# EAGLE design Beta22_SMD (EAGLE 9.4.2)
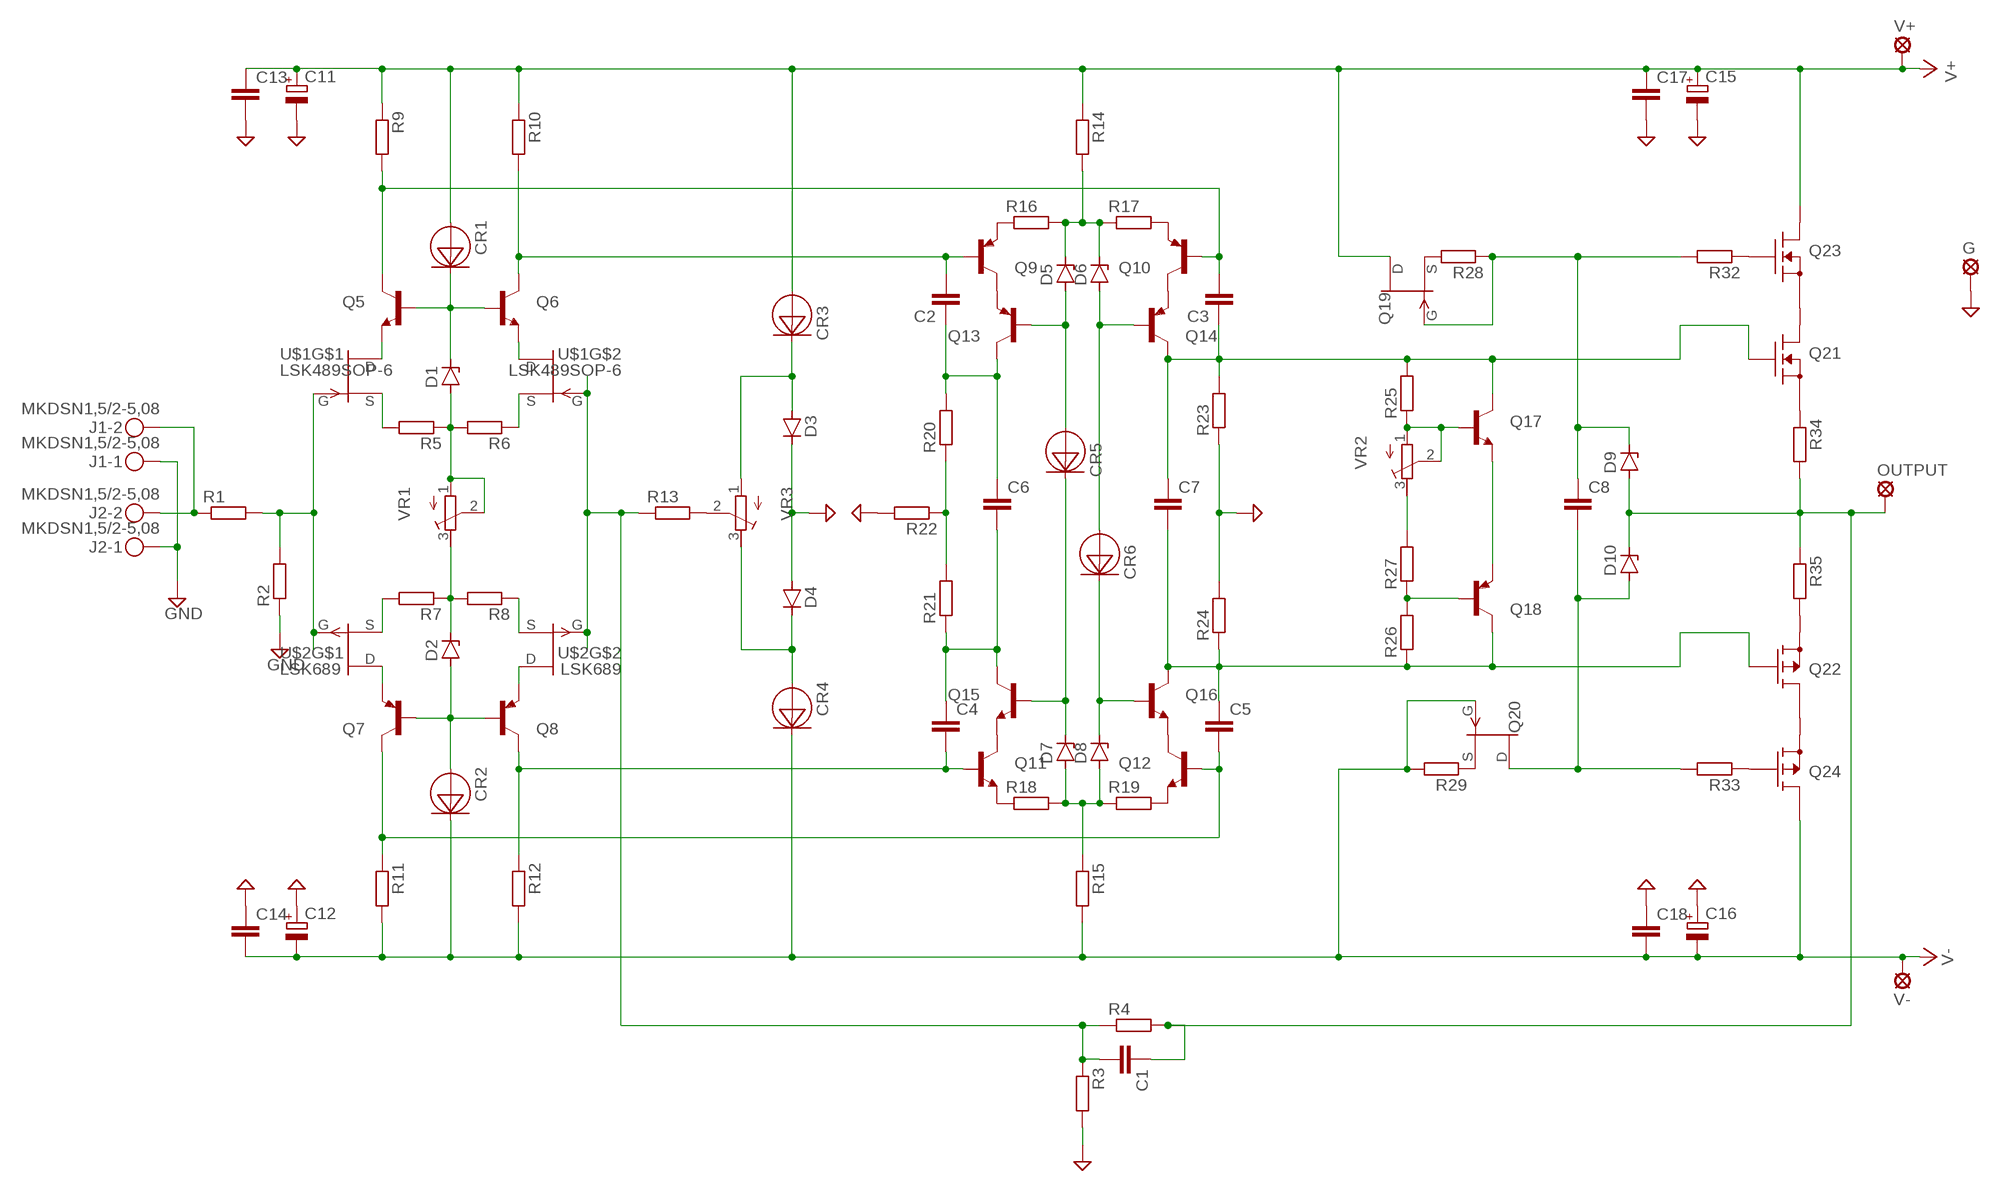
[diagram p0: schematic, sheet 1]

## Parts
C1  C-EUC0805  [C0805]
C2  C-EUC0805  [C0805]
C3  C-EUC0805  [C0805]
C4  C-EUC0805  [C0805]
C5  C-EUC0805  [C0805]
C6  C-EUC0805  [C0805]
C7  C-EUC0805  [C0805]
C8  C-EUC0805  [C0805]
C11  CPOL-EUE5-13  [E5-13]
C12  CPOL-EUE5-13  [E5-13]
C13  C-EU050-055X075  [C050-055X075]
C14  C-EU050-055X075  [C050-055X075]
C15  CPOL-EUE7.5-18  [E7,5-18]
C16  CPOL-EUE7.5-18  [E7,5-18]
C17  C-EU050-055X075  [C050-055X075]
C18  C-EU050-055X075  [C050-055X075]
CR1  1N5283  [SMD]
CR2  1N5283  [SMD]
CR3  1N5283  [SMD]
CR4  1N5283  [SMD]
CR5  1N5283  [SMD]
CR6  1N5283  [SMD]
D1  ZENER-DIODESOD80C  [SOD80C]
D2  ZENER-DIODESOD80C  [SOD80C]
D3  DIODE-SOD80C  [SOD80C]
D4  DIODE-SOD80C  [SOD80C]
D5  ZENER-DIODESOD80C  [SOD80C]
D6  ZENER-DIODESOD80C  [SOD80C]
D7  ZENER-DIODESOD80C  [SOD80C]
D8  ZENER-DIODESOD80C  [SOD80C]
D9  ZENER-DIODESOD80C  [SOD80C]
D10  ZENER-DIODESOD80C  [SOD80C]
G  SE14  [SE14]
J1  MKDSN1,5/2-5,08  [MKDSN1,5/2-5,08]
J2  MKDSN1,5/2-5,08  [MKDSN1,5/2-5,08]
OUTPUT  SE14  [SE14]
Q5  BC550C  [TO92-EBC]
Q6  BC550C  [TO92-EBC]
Q7  BC560  [TO92_1]
Q8  BC560  [TO92_1]
Q9  BC560  [TO92_1]
Q10  BC560  [TO92_1]
Q11  BC550C  [TO92-EBC]
Q12  BC550C  [TO92-EBC]
Q13  BC560  [TO92_1]
Q14  BC560  [TO92_1]
Q15  BC550C  [TO92-EBC]
Q16  BC550C  [TO92-EBC]
Q17  BC550C  [TO92-EBC]
Q18  BC560  [TO92_1]
Q19  SST5486  [SOT23]
Q20  SST5486  [SOT23]
Q21  IRFZ24N  [TO220V]
Q22  IRFZ34N  [TO220V]
Q23  IRFZ24N  [TO220V]
Q24  IRFZ34N  [TO220V]
R1  R-EU_MELF0204W  [MINI_MELF-0204W]
R2  R-EU_MELF0204W  [MINI_MELF-0204W]
R3  R-EU_MELF0204W  [MINI_MELF-0204W]
R4  R-EU_MELF0204W  [MINI_MELF-0204W]
R5  R-EU_MELF0204W  [MINI_MELF-0204W]
R6  R-EU_MELF0204W  [MINI_MELF-0204W]
R7  R-EU_MELF0204W  [MINI_MELF-0204W]
R8  R-EU_MELF0204W  [MINI_MELF-0204W]
R9  R-EU_MELF0204W  [MINI_MELF-0204W]
R10  R-EU_MELF0204W  [MINI_MELF-0204W]
R11  R-EU_MELF0204W  [MINI_MELF-0204W]
R12  R-EU_MELF0204W  [MINI_MELF-0204W]
R13  R-EU_MELF0204W  [MINI_MELF-0204W]
R14  R-EU_MELF0204W  [MINI_MELF-0204W]
R15  R-EU_MELF0204W  [MINI_MELF-0204W]
R16  R-EU_MELF0204W  [MINI_MELF-0204W]
R17  R-EU_MELF0204W  [MINI_MELF-0204W]
R18  R-EU_MELF0204W  [MINI_MELF-0204W]
R19  R-EU_MELF0204W  [MINI_MELF-0204W]
R20  R-EU_MELF0204W  [MINI_MELF-0204W]
R21  R-EU_MELF0204W  [MINI_MELF-0204W]
R22  R-EU_MELF0204W  [MINI_MELF-0204W]
R23  R-EU_MELF0204W  [MINI_MELF-0204W]
R24  R-EU_MELF0204W  [MINI_MELF-0204W]
R25  R-EU_MELF0204W  [MINI_MELF-0204W]
R26  R-EU_MELF0204W  [MINI_MELF-0204W]
R27  R-EU_MELF0204W  [MINI_MELF-0204W]
R28  R-EU_MELF0204W  [MINI_MELF-0204W]
R29  R-EU_MELF0204W  [MINI_MELF-0204W]
R32  R-EU_MELF0204W  [MINI_MELF-0204W]
R33  R-EU_MELF0204W  [MINI_MELF-0204W]
R34  R-EU_0617/17  [0617/17]
R35  R-EU_0617/17  [0617/17]
U$1  LSK489SOP-6  [SOT-23-6]
U$2  LSK689  [SOT-23-6]
V+  SE14  [SE14]
V-  SE14  [SE14]
VR1  R-TRIMM3296W  [RTRIM3296W]
VR2  R-TRIMM3296W  [RTRIM3296W]
VR3  R-TRIMM3296W  [RTRIM3296W]

## Nets
GND: C11.- C12.+ C13.2 C14.1 C15.- C16.+ C17.2 C18.1 D3.C D4.A G.MP J1.1 J2.1 R2.1 R3.2 R22.2 R23.1 R24.2
N$1: R1.2 R2.2 U$1.1(G) U$2.1(G)
N$2: Q6.E U$1.5(D)
N$3: R5.2 U$1.3(S)
N$4: R7.2 U$2.3(S)
N$5: Q5.E U$1.2(D)
N$6: Q7.3(E) U$2.2(D)
N$7: R6.1 U$1.6(S)
N$8: D2.C R7.1 R8.2 VR1.3(E)
N$9: R8.1 U$2.6(S)
N$10: Q8.3(E) U$2.5(D)
N$11: D1.A R5.1 R6.2 VR1.1(A) VR1.2(S)
N$12: CR2.ANODE D2.A Q7.2(B) Q8.2(B)
N$13: C3.2 Q5.C Q10.2(B) R9.2
N$14: C2.2 Q6.C Q9.2(B) R10.2
N$15: CR4.ANODE D4.C VR3.3(E)
N$16: CR1.CATHODE D1.C Q5.B Q6.B
N$18: C5.2 Q7.1(C) Q12.B R11.1
N$19: J1.2 J2.2 R1.1
N$20: C8.2 D10.A Q20.1(D) R33.2
N$21: C1.2 R3.1 R4.1 R13.1 U$1.4(G) U$2.4(G)
N$22: R13.2 VR3.2(S)
N$23: Q9.1(C) Q13.3(E)
N$24: CR3.CATHODE D3.A VR3.1(A)
N$25: Q10.1(C) Q14.3(E)
N$26: C1.1 D9.A D10.C OUTPUT.MP R4.2 R34.2 R35.1
N$27: Q9.3(E) R16.1
N$28: Q10.3(E) R17.2
N$29: D5.C D6.C R14.2 R16.2 R17.1
N$30: Q11.E R18.1
N$31: Q12.E R19.2
N$32: D7.A D8.A R15.1 R18.2 R19.1
N$33: C4.2 Q8.1(C) Q11.B R12.1
N$34: R20.1 R21.2 R22.1
N$35: C2.1 C6.1 Q13.1(C) R20.2
N$36: C4.1 C6.2 Q15.C R21.1
N$37: Q11.C Q15.E
N$38: Q12.C Q16.E
N$39: Q17.B R25.1 VR2.1(A) VR2.2(S)
N$40: Q19.2(S) R28.2
N$41: Q20.2(S) R29.1
N$42: C3.1 C7.1 Q14.1(C) Q17.C Q21.1(G) R23.2 R25.2
N$43: CR5.ANODE D5.A Q13.2(B)
N$44: CR6.ANODE D6.A Q14.2(B)
N$45: CR5.CATHODE D7.C Q15.B
N$46: CR6.CATHODE D8.C Q16.B
N$47: Q18.2(B) R26.2 R27.1
N$48: R27.2 VR2.3(E)
N$49: Q17.E Q18.3(E)
N$50: C5.1 C7.2 Q16.C Q18.1(C) Q22.1(G) R24.1 R26.1
N$54: C8.1 D9.C Q19.3(G) R28.1 R32.2
N$57: Q21.2(D) Q23.3(S)
N$58: Q22.2(D) Q24.3(S)
N$59: Q23.1(G) R32.1
N$60: Q24.1(G) R33.1
N$62: Q21.3(S) R34.1
N$63: Q22.3(S) R35.2
V+: C11.+ C13.1 C15.+ C17.1 CR1.ANODE CR3.ANODE Q19.1(D) Q23.2(D) R9.1 R10.1 R14.1 V+.MP
V-: C12.- C14.2 C16.- C18.2 CR2.CATHODE CR4.CATHODE Q20.3(G) Q24.2(D) R11.2 R12.2 R15.2 R29.2 V-.MP

## Library data of the parts
C1-C8 C13 C14 C17 C18 = Vwvwbg:C-EU: CAPACITOR, European symbol
C11 C12 C15 C16 = Vwvwbg:CPOL-EU: POLARIZED CAPACITOR, European symbol
CR1-CR6 = crd:1N5283: 0.22 mA through 4.23 mA current regulating diode series
D1 D2 D5-D10 = diode:ZENER-DIODE: Z-Diode
D3 D4 = diode:DIODE-: DIODE
G OUTPUT V+ V- = solpad:SE14: SOLDER PAD E1553, drill 1,4mm, distributor Buerklin, 07F820
J1 J2 = con-phoenix-508:MKDSN1,5/2-5,08: MKDSN 1,5/ 2-5,08 Printklemme Nennstrom: 13,5 A Nennspannung: 250 V Rastermaß: 5,08 mm Polzahl: 2 Anschlussart: Schraubanschluss Montage: Löten Anschlussrichtung Leiter/Platine: 0 ° Artikelnummer: 1729128 Source: http://eshop.phoenixcontact.com .. 1729128.pdf
Q5 Q6 Q11 Q12 Q15-Q17 = transistor-npn:BC550*: NPN Transistor
Q7-Q10 Q13 Q14 Q18 = tranzistory PNP:BC560*: PNP Transistror
Q19 Q20 = transistor-fet:?548*: N-Channel JFETs Source: VISHAY 2N5484.pdf Compatible: TO92 2N5245 J304 J305 U310 J308 J309 J310 TO72 2N4416 2N4416A 2N3823 2N4351 3N169 3N170 3N171 MFE3002 TO18 2N3796 2N3797 MFE825 Source: Motorola European Master Guide Pacge 3-59
Q21 Q23 = transistor-fet:IRFZ24N
Q22 Q24 = transistor-fet:IRFZ34N
R1-R29 R32-R35 = Vwvwbg:R-EU_: RESISTOR, European symbol
U$1 = Vwvwbg:LSK489
U$2 = Vwvwbg:LSK689
VR1-VR3 = resistor:R-TRIMM: Trimm resistor

## Board
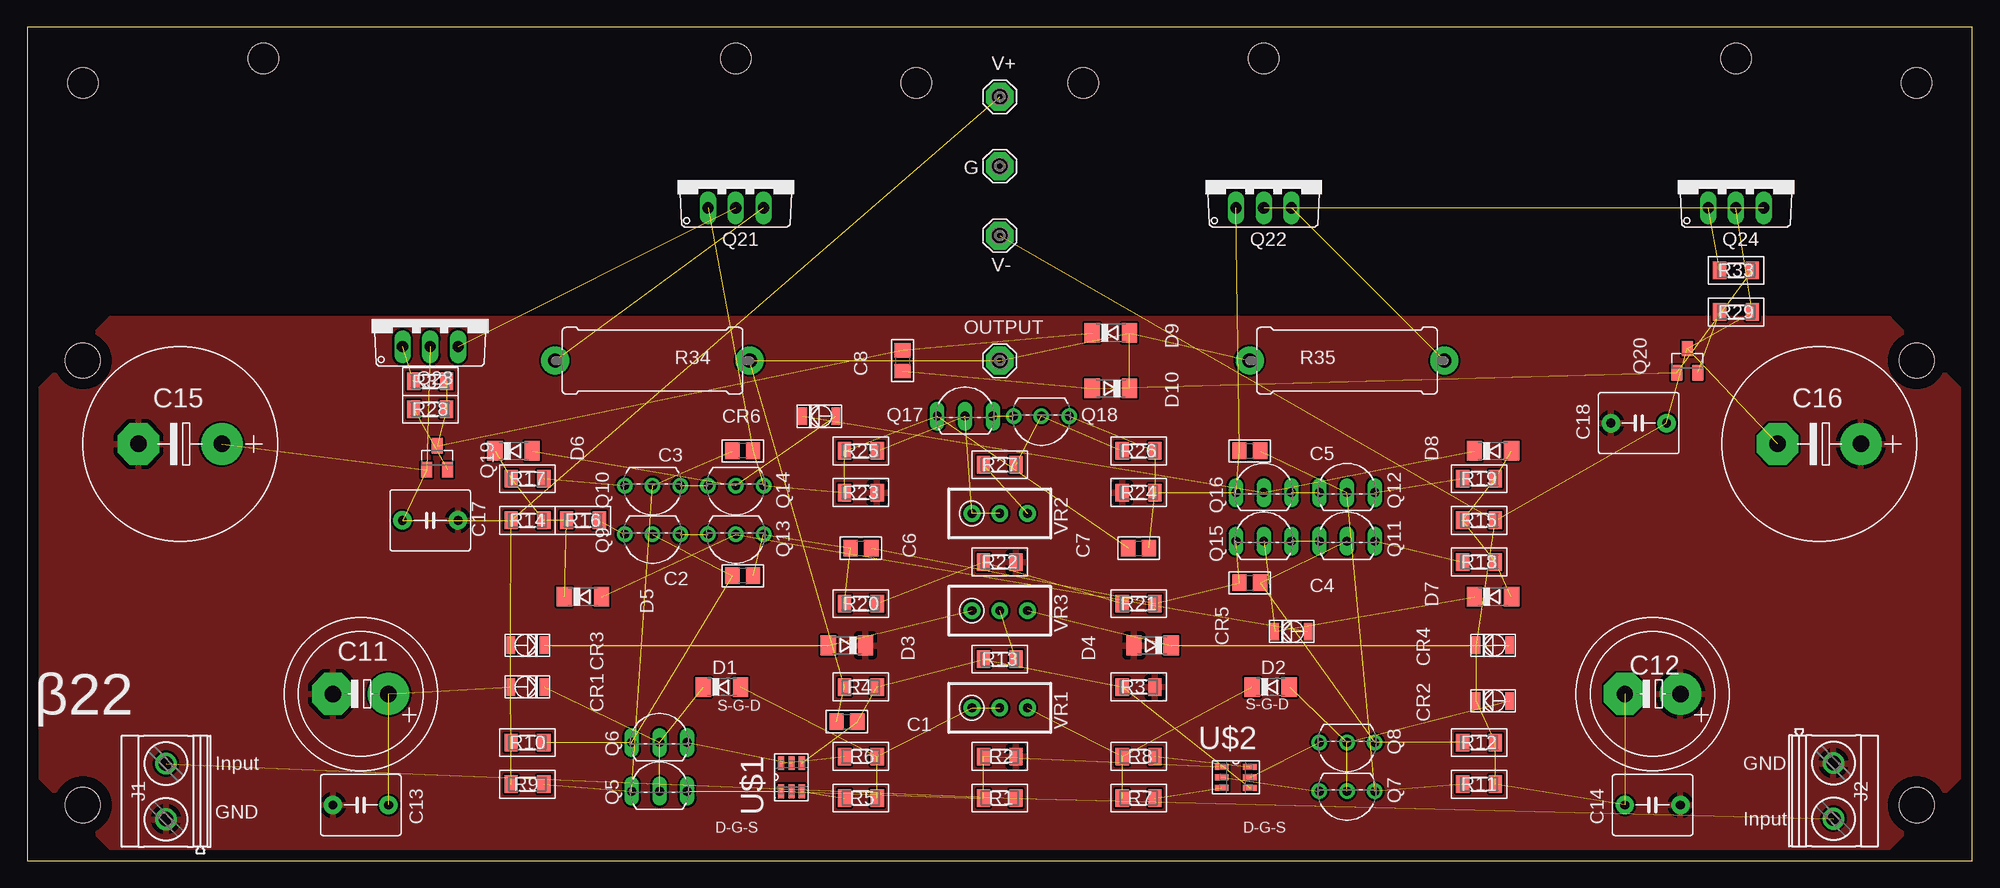
[diagram p1: board, top side]
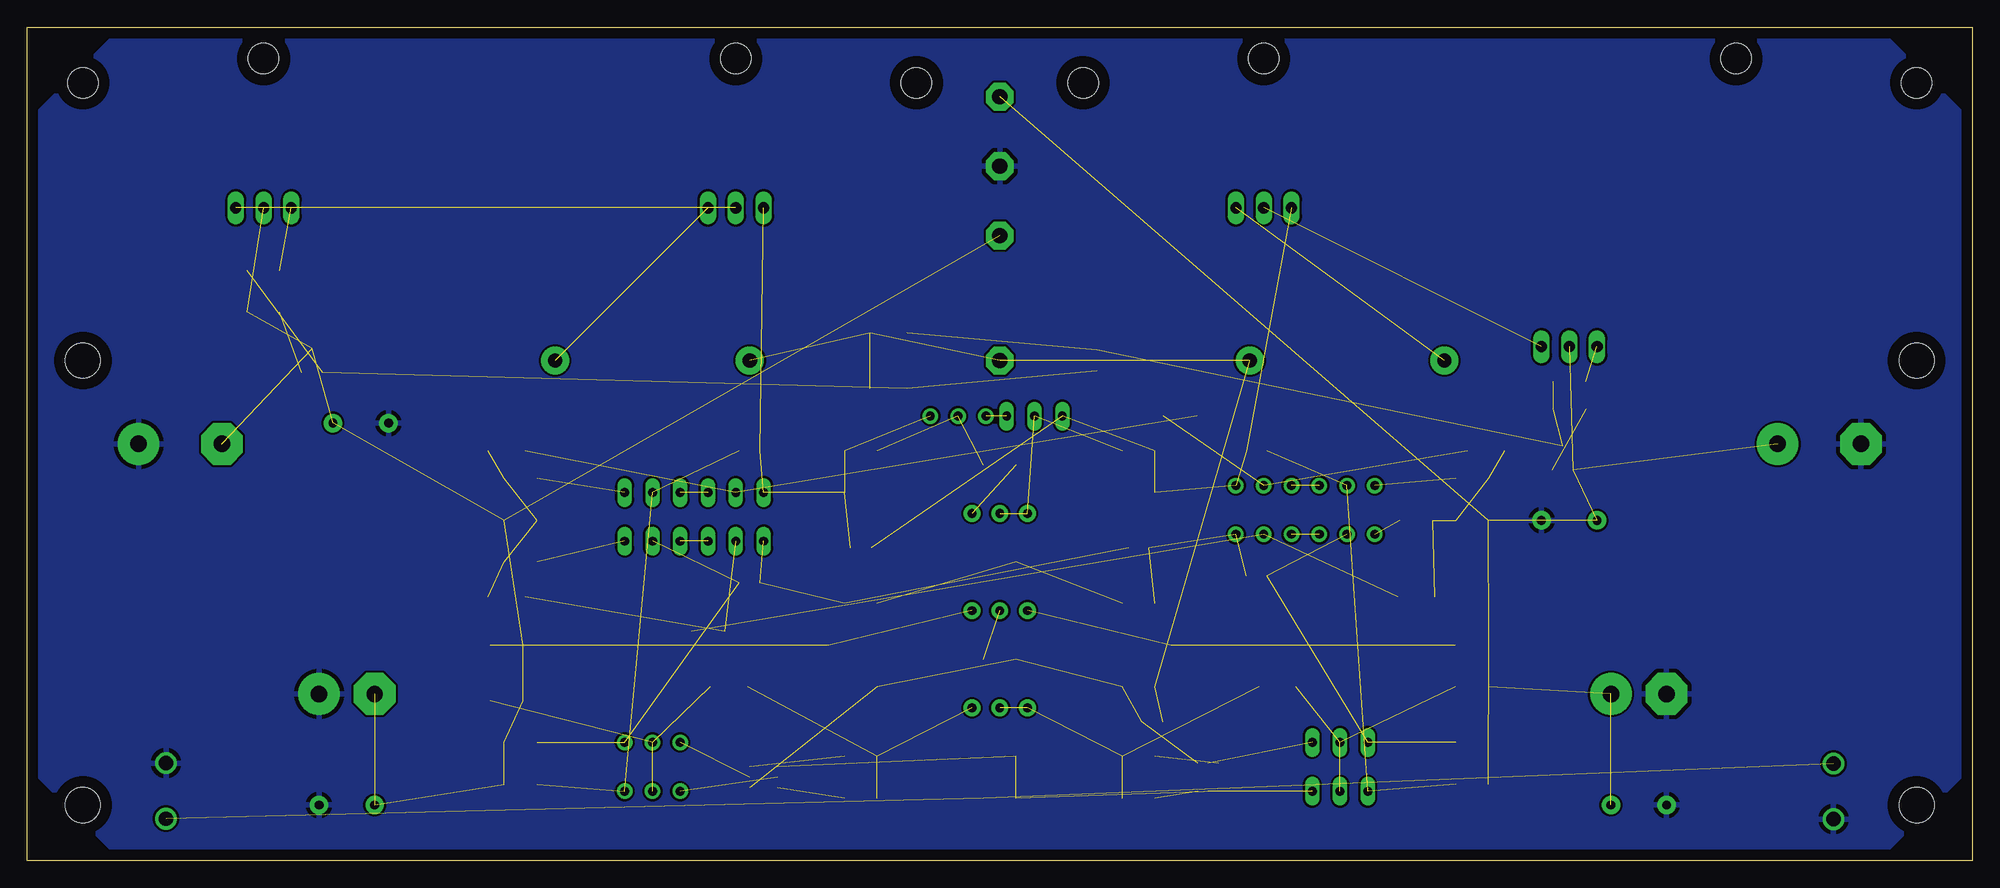
[diagram p2: board, bottom side, seen from below]

Size 177.8 x 76.2 mm. Coordinates in mm from the lower left corner, seen from the top.
Outline: 0,0 177.8,0 177.8,76.2 0,76.2 0,0
Copper layers (1*16): Top 0.035mm / dielectric 1.5mm / Bottom 0.035mm
Design rules "default *": minimum track width 10mil, minimum drill 24mil, track to track 8mil, track to pad 8mil, pad to pad 8mil, via to via 8mil, smd to smd 8mil, copper to edge 40mil, drill to drill 8mil, minimum pad ring 10mil, minimum via ring 8mil, stop-mask expansion 4mil, vias tented up to drill 0mil, thermal gap 15mil
Holes 3.2 mm at 5.08,5.08 172.72,5.08 5.08,45.72 172.72,45.72
Holes 2.8 mm at 5.08,71.12 21.59,73.34 64.77,73.34 113.03,73.34 156.21,73.34 172.72,71.12 81.28,71.12 96.52,71.12

### Footprints (pad centres in the part's own frame; a part is rotated, then mirrored left to right if it is on the bottom)
C0805 = smd 1.3 x 1.5: 1 -0.95,0; 2 0.95,0
E5-13 = drill 1.5 pad 3.81: + -2.54,0 | drill 1.5 pad 3.81 octagon: - 2.54,0
C050-055X075 = drill 0.813 pad 1.676: 1 -2.54,0; 2 2.54,0
E7,5-18 = drill 1.5 pad 3.81: + -3.81,0 | drill 1.5 pad 3.81 octagon: - 3.81,0
SMD = smd 0.8 x 1.6: ANODE 1.525,0; CATHODE -1.525,0
SOD80C = smd 1.4 x 1.8: A 1.7,0; C -1.7,0
SE14 = drill 1.397 pad 2.54 octagon: MP 0,0
MKDSN1,5/2-5,08 = drill 1.3 pad 2: 1 -2.561,0.025; 2 2.519,0.025
TO92-EBC = drill 0.813 long: B 0,-1.27; C -2.54,-1.27; E 2.54,-1.27
TO92_1 = drill 0.813 pad 1.422: 1 -2.54,0; 2 0,0; 3 2.54,0
SOT23 = smd 1 x 1.4: 1 -0.95,-1.1; 2 0.95,-1.1; 3 0,1.1
TO220V = drill 1.016 long: 1 -2.54,-2.54; 2 0,-2.54; 3 2.54,-2.54
MINI_MELF-0204W = smd 1.2 x 1.6: 1 -1.5,0; 2 1.5,0
0617/17 = drill 1.3 pad 2.54: 1 -8.89,0; 2 8.89,0
SOT-23-6 = smd 1.27 x 0.559: 1 -1.295,0.95; 2 -1.295,0; 3 -1.295,-0.95; 4 1.295,-0.95; 5 1.295,0; 6 1.295,0.95
RTRIM3296W = drill 0.8 pad 1.524: 1 0,-2.54; 2 0,0; 3 0,2.54

### Placement (x,y rotation side)
C1  74.93,12.7 0 top
C2  65.41,26.04 180 top
C3  65.41,37.47 180 top
C4  111.76,25.4 0 top
C5  111.76,37.47 0 top
C6  76.2,28.57 0 top
C7  101.6,28.57 0 top
C8  80.01,45.72 270 top
C11  30.48,15.24 180 top
C12  148.59,15.24 180 top
C13  30.48,5.08 180 top
C14  148.59,5.08 180 top
C15  13.97,38.1 180 top
C16  163.83,38.1 180 top
C17  36.83,31.11 0 top
C18  147.32,40.01 0 top
CR1  45.72,15.88 180 top
CR2  133.99,14.61 0 top
CR3  45.72,19.68 180 top
CR4  133.99,19.68 0 top
CR5  115.57,20.95 0 top
CR6  72.39,40.64 0 top
D1  63.5,15.88 0 top
D2  113.67,15.88 0 top
D3  74.93,19.68 180 top
D4  102.87,19.68 180 top
D5  50.8,24.13 0 top
D6  44.45,37.47 0 top
D7  133.99,24.13 0 top
D8  133.99,37.47 0 top
D9  99.06,48.26 0 top
D10  99.06,43.18 180 top
G  88.9,63.5 0 top
J1  12.7,6.35 90 top
J2  165.1,6.35 270 top
OUTPUT  88.9,45.72 0 top
Q5  57.78,7.62 0 top
Q6  57.78,12.06 0 top
Q7  120.65,6.35 180 top
Q8  120.65,10.79 180 top
Q9  57.15,29.84 180 top
Q10  57.15,34.29 180 top
Q11  120.65,30.48 0 top
Q12  120.65,34.92 0 top
Q13  64.77,29.84 180 top
Q14  64.77,34.29 180 top
Q15  113.03,30.48 0 top
Q16  113.03,34.92 0 top
Q17  85.72,41.91 0 top
Q18  92.71,40.64 180 top
Q19  37.47,36.83 0 top
Q20  151.76,45.72 0 top
Q21  64.77,62.23 0 top
Q22  113.03,62.23 0 top
Q23  36.83,49.53 0 top
Q24  156.21,62.23 0 top
R1  88.9,5.71 180 top
R2  88.9,9.53 180 top
R3  101.6,15.88 0 top
R4  76.2,15.88 180 top
R5  76.2,5.71 180 top
R6  76.2,9.53 0 top
R7  101.6,5.71 0 top
R8  101.6,9.53 180 top
R9  45.72,6.99 0 top
R10  45.72,10.79 0 top
R11  132.72,6.99 0 top
R12  132.72,10.79 0 top
R13  88.9,18.41 0 top
R14  45.72,31.11 0 top
R15  132.72,31.11 0 top
R16  50.8,31.11 180 top
R17  45.72,34.92 0 top
R18  132.72,27.3 0 top
R19  132.72,34.92 180 top
R20  76.2,23.5 180 top
R21  101.6,23.5 180 top
R22  88.9,27.3 0 top
R23  76.2,33.66 180 top
R24  101.6,33.66 180 top
R25  76.2,37.47 180 top
R26  101.6,37.47 180 top
R27  88.9,36.2 180 top
R28  36.83,41.27 180 top
R29  156.21,50.16 0 top
R32  36.83,43.81 0 top
R33  156.21,53.98 0 top
R34  57.15,45.72 0 top
R35  120.65,45.72 0 top
U$1  69.85,7.62 90 top
U$2  110.49,7.62 0 top
V+  88.9,69.85 0 top
V-  88.9,57.15 0 top
VR1  88.9,13.97 270 top
VR2  88.9,31.75 270 top
VR3  88.9,22.86 270 top

### Tracks (layer width: path | path; a pad name or v marks a point on that pad's centre or on a via)
GND
  pour Bottom: 0,8.89 8.89,0 168.91,0 177.8,8.89 177.8,67.31 168.91,76.2 8.89,76.2 0,67.31
  pour Top: 7.62,49.53 0,41.91 0,8.89 8.89,0 168.91,0 177.8,8.89 177.8,41.91 170.18,49.53
N$1  (3 unrouted)
N$2  (1 unrouted)
N$3  (1 unrouted)
N$4  (1 unrouted)
N$5  (1 unrouted)
N$6  (1 unrouted)
N$7  (1 unrouted)
N$8  (3 unrouted)
N$9  (1 unrouted)
N$10  (1 unrouted)
N$11  (4 unrouted)
N$12  (3 unrouted)
N$13  (3 unrouted)
N$14  (3 unrouted)
N$15  (2 unrouted)
N$16  (3 unrouted)
N$18  (3 unrouted)
N$19  (2 unrouted)
N$20  (3 unrouted)
N$21  (5 unrouted)
N$22  (1 unrouted)
N$23  (1 unrouted)
N$24  (2 unrouted)
N$25  (1 unrouted)
N$26  (6 unrouted)
N$27  (1 unrouted)
N$28  (1 unrouted)
N$29  (4 unrouted)
N$30  (1 unrouted)
N$31  (1 unrouted)
N$32  (4 unrouted)
N$33  (3 unrouted)
N$34  (2 unrouted)
N$35  (3 unrouted)
N$36  (3 unrouted)
N$37  (1 unrouted)
N$38  (1 unrouted)
N$39  (3 unrouted)
N$40  (1 unrouted)
N$41  (1 unrouted)
N$42  (6 unrouted)
N$43  (2 unrouted)
N$44  (2 unrouted)
N$45  (2 unrouted)
N$46  (2 unrouted)
N$47  (2 unrouted)
N$48  (1 unrouted)
N$49  (1 unrouted)
N$50  (6 unrouted)
N$54  (4 unrouted)
N$57  (1 unrouted)
N$58  (1 unrouted)
N$59  (1 unrouted)
N$60  (1 unrouted)
N$62  (1 unrouted)
N$63  (1 unrouted)
V+  (11 unrouted)
V-  (12 unrouted)

### Text on the board
tPlace: S-G-D | S-G-D | β22 | Input | GND | GND | D-G-S | D-G-S | Input